# EAGLE design sells (EAGLE 6.4)
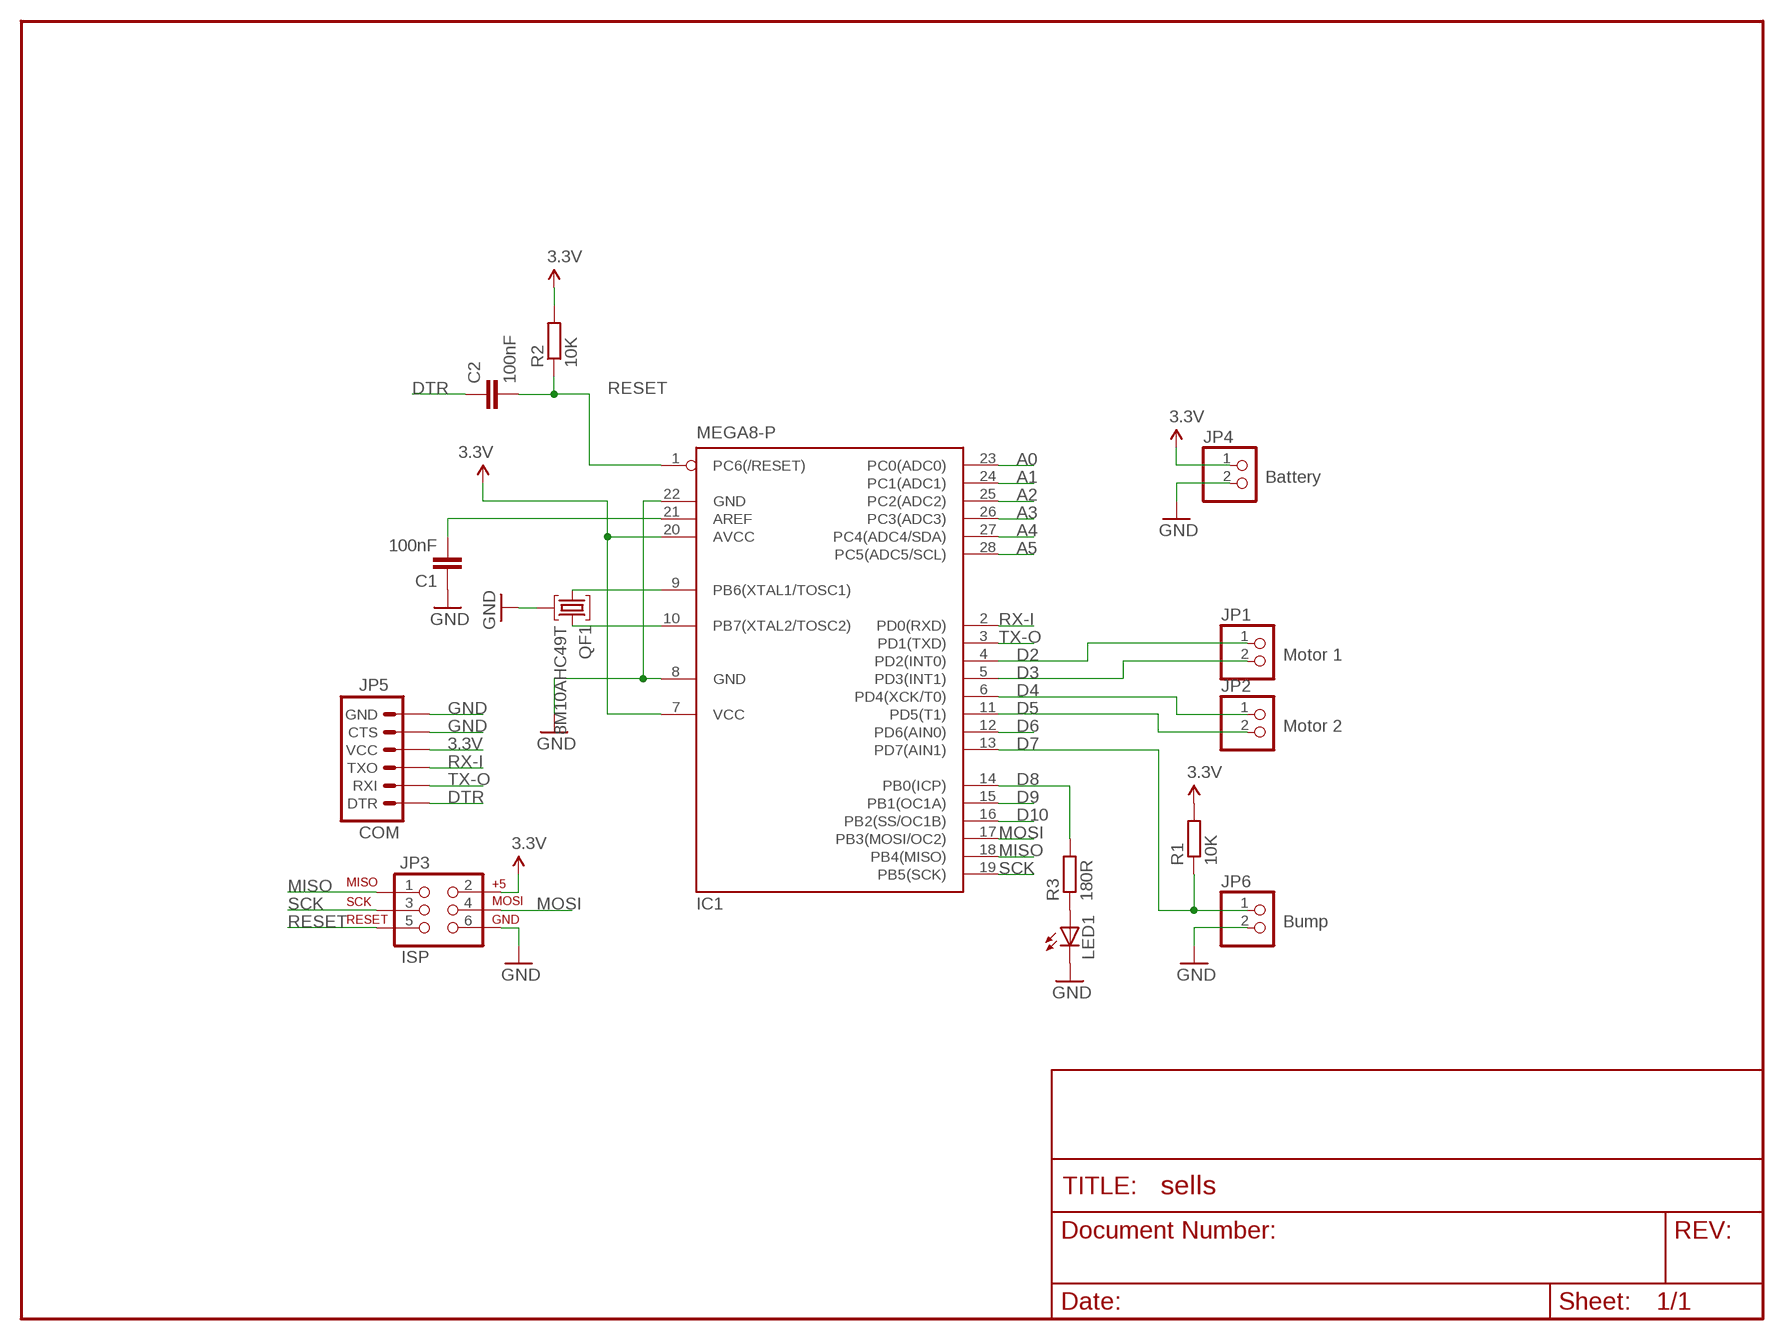
[diagram p0: schematic, sheet 1]

## Parts
C1  100nF  C-EU050-050X075  [C050-050X075]
C2  100nF  C-EU050-050X075  [C050-050X075]
IC1  MEGA8-P  [DIL28-3]
JP1  PINHD-1X2  [1X02]
JP2  PINHD-1X2  [1X02]
JP3  ISP  AVR_SPI_PRG_6PTH  [2X3]
JP4  PINHD-1X2  [1X02]
JP5  COM  ARDUINO_SERIAL_PROGRAMPTH  [1X06]
JP6  PINHD-1X2  [1X02]
LED1  LED3MM  [LED3MM]
QF1  8M10AHC49T  [HC49U]
R1  10K  R-EU_0207/10  [0207/10]
R2  10K  R-EU_0207/10  [0207/10]
R3  180R  R-EU_0207/10  [0207/10]

## Nets
3.3V: IC1.7(VCC) IC1.20(AVCC) JP3.2 JP4.1 JP5.4(VCC) R1.2 R2.2
A0: IC1.23(PC0(ADC0))
A1: IC1.24(PC1(ADC1))
A2: IC1.25(PC2(ADC2))
A3: IC1.26(PC3(ADC3))
A4: IC1.27(PC4(ADC4/SDA))
A5: IC1.28(PC5(ADC5/SCL))
D2: IC1.4(PD2(INT0)) JP1.1
D3: IC1.5(PD3(INT1)) JP1.2
D4: IC1.6(PD4(XCK/T0)) JP2.1
D5: IC1.11(PD5(T1)) JP2.2
D6: IC1.12(PD6(AIN0))
D7: IC1.13(PD7(AIN1)) JP6.1 R1.1
D8: IC1.14(PB0(ICP)) R3.2
D9: IC1.15(PB1(OC1A))
D10: IC1.16(PB2(SS/OC1B))
DTR: C2.1 JP5.1(DTR)
GND [vcc]: C1.1 IC1.8(GND) IC1.22(GND) JP3.6 JP4.2 JP5.5(CTS) JP5.6(GND) JP6.2 LED1.K(C) QF1.2
MISO: IC1.18(PB4(MISO)) JP3.1
MOSI: IC1.17(PB3(MOSI/OC2)) JP3.4
N$1: IC1.9(PB6(XTAL1/TOSC1)) QF1.1
N$2: IC1.10(PB7(XTAL2/TOSC2)) QF1.3
N$3: C1.2 IC1.21(AREF)
N$4: LED1.A R3.1
RESET: C2.2 IC1.1(PC6(/RESET)) JP3.5 R2.1
RX-I: IC1.2(PD0(RXD)) JP5.3(TXO)
SCK: IC1.19(PB5(SCK)) JP3.3
TX-O: IC1.3(PD1(TXD)) JP5.2(RXI)

## Notes on the sheet
- Battery
- Motor 1
- Motor 2
- Bump

## Library data of the parts
C1 C2 = rcl:C-EU: CAPACITOR, European symbol
IC1 = atmel:MEGA8-P: MICROCONTROLLER 8 Kbytes FLASH, 1 kbytes SRAM, 512 bytes EEPROM, USART, 4-channel 10 bit ADC, 2-channel 8 bit ADC Pin compatible with Atmega48, ATMega88, ATMega168 Source: avr.lbr; OC_FARNELL: unknown; OC_NEWARK: unknown
JP1 JP2 JP4 JP6 = pinhead:PINHD-1X2: PIN HEADER
JP3 = SparkFun:AVR_SPI_PRG_6: AVR ISP 6 Pin This is the reduced ISP connector for AVR programming. Common on Arduino. This footprint will take up less PCB space and can be used with a 10-pin to 6-pin adapter such as SKU: BOB-08508
JP5 = SparkFun:ARDUINO_SERIAL_PROGRAM
LED1 = led:LED: LED OSRAM: - CHIPLED LG R971, LG N971, LY N971, LG Q971, LY Q971, LO R971, LY R971 LH N974, LH R974 LS Q976, LO Q976, LY Q976 LO Q996 - Hyper CHIPLED LW Q18S LB Q993, LB Q99A, LB R99A - SideLED LS A670, LO A670, LY A670, LG A670, LP A670 LB A673, LV A673, LT A673, LW A673 LH A674 LY A675 LS A676, LA A676, LO A676, LY A676, LW A676 LS A679, LY A679, LG A679 - Hyper Micro SIDELED® LS Y876, LA Y876, LO Y876, LY Y876 LT Y87S - SmartLED LW L88C, LW L88S LB L89C, LB L89S, LG L890 LS L89K, LO L89K, LY L89K LS L896, LA L896, LO L896, LY L896 - TOPLED LS T670, LO T670, LY T670, LG T670, LP T670 LSG T670, LSP T670, LSY T670, LOP T670, LYG T670 LG T671, LOG T671, LSG T671 LB T673, LV T673, LT T673, LW T673 LH T674 LS T676, LA T676, LO T676, LY T676, LB T676, LH T676, LSB T676, LW T676 LB T67C, LV T67C, LT T67C, LS T67K, LO T67K, LY T67K, LW E67C LS E67B, LA E67B, LO E67B, LY E67B, LB E67C, LV E67C, LT E67C LW T67C LS T679, LY T679, LG T679 LS T770, LO T770, LY T770, LG T770, LP T770 LB T773, LV T773, LT T773, LW T773 LH T774 LS E675, LA E675, LY E675, LS T675 LS T776, LA T776, LO T776, LY T776, LB T776 LHGB T686 LT T68C, LB T68C - Hyper Mini TOPLED® LB M676 - Mini TOPLED Santana® LG M470 LS M47K, LO M47K, LY M47K Source: http://www.osram.convergy.de LUXEON: - LUMILED® LXK2-PW12-R00, LXK2-PW12-S00, LXK2-PW14-U00, LXK2-PW14-V00 LXK2-PM12-R00, LXK2-PM12-S00, LXK2-PM14-U00 LXK2-PE12-Q00, LXK2-PE12-R00, LXK2-PE12-S00, LXK2-PE14-T00, LXK2-PE14-U00 LXK2-PB12-K00, LXK2-PB12-L00, LXK2-PB12-M00, LXK2-PB14-N00, LXK2-PB14-P00, LXK2-PB14-Q00 LXK2-PR12-L00, LXK2-PR12-M00, LXK2-PR14-Q00, LXK2-PR14-R00 LXK2-PD12-Q00, LXK2-PD12-R00, LXK2-PD12-S00 LXK2-PH12-R00, LXK2-PH12-S00 LXK2-PL12-P00, LXK2-PL12-Q00, LXK2-PL12-R00 Source: www.luxeon.com KINGBRIGHT: KA-3528ASYC Source: www.kingbright.com
QF1 = crystal:8M10AHC49T: Monolithic Crystal Filters Source: www.vanlong.com; OC_FARNELL: unknown; OC_NEWARK: unknown
R1-R3 = rcl:R-EU_: RESISTOR, European symbol

## Net classes
0 default: width 0.203 mm
1 vcc: width 0.254 mm

## Board
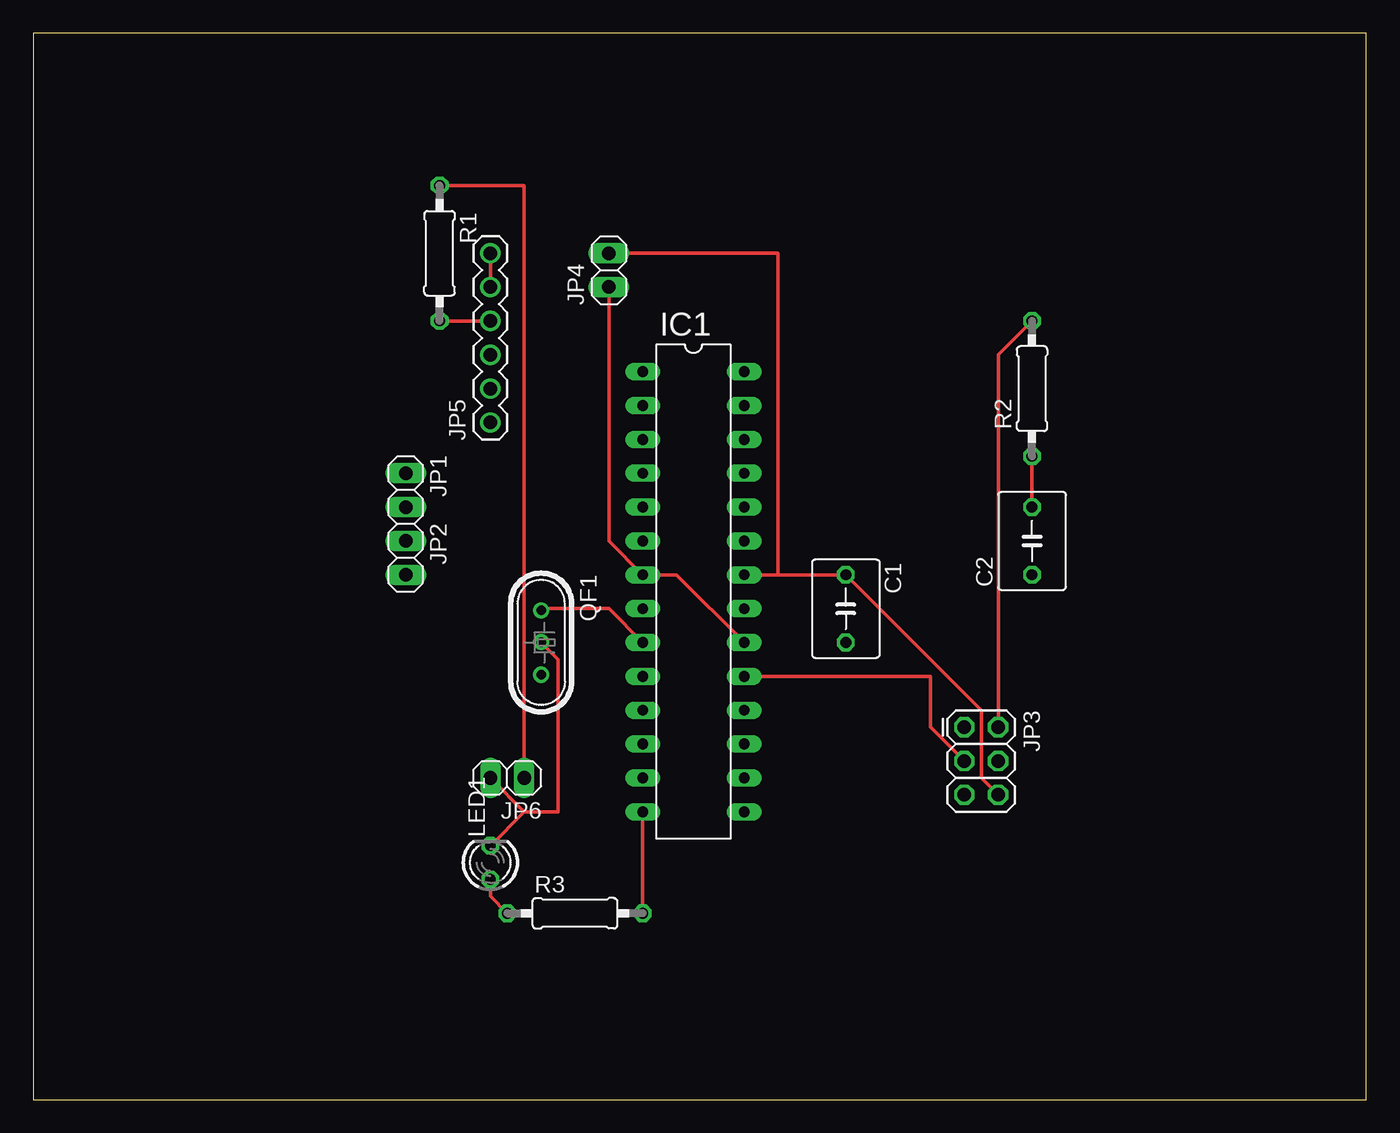
[diagram p1: board, top side]
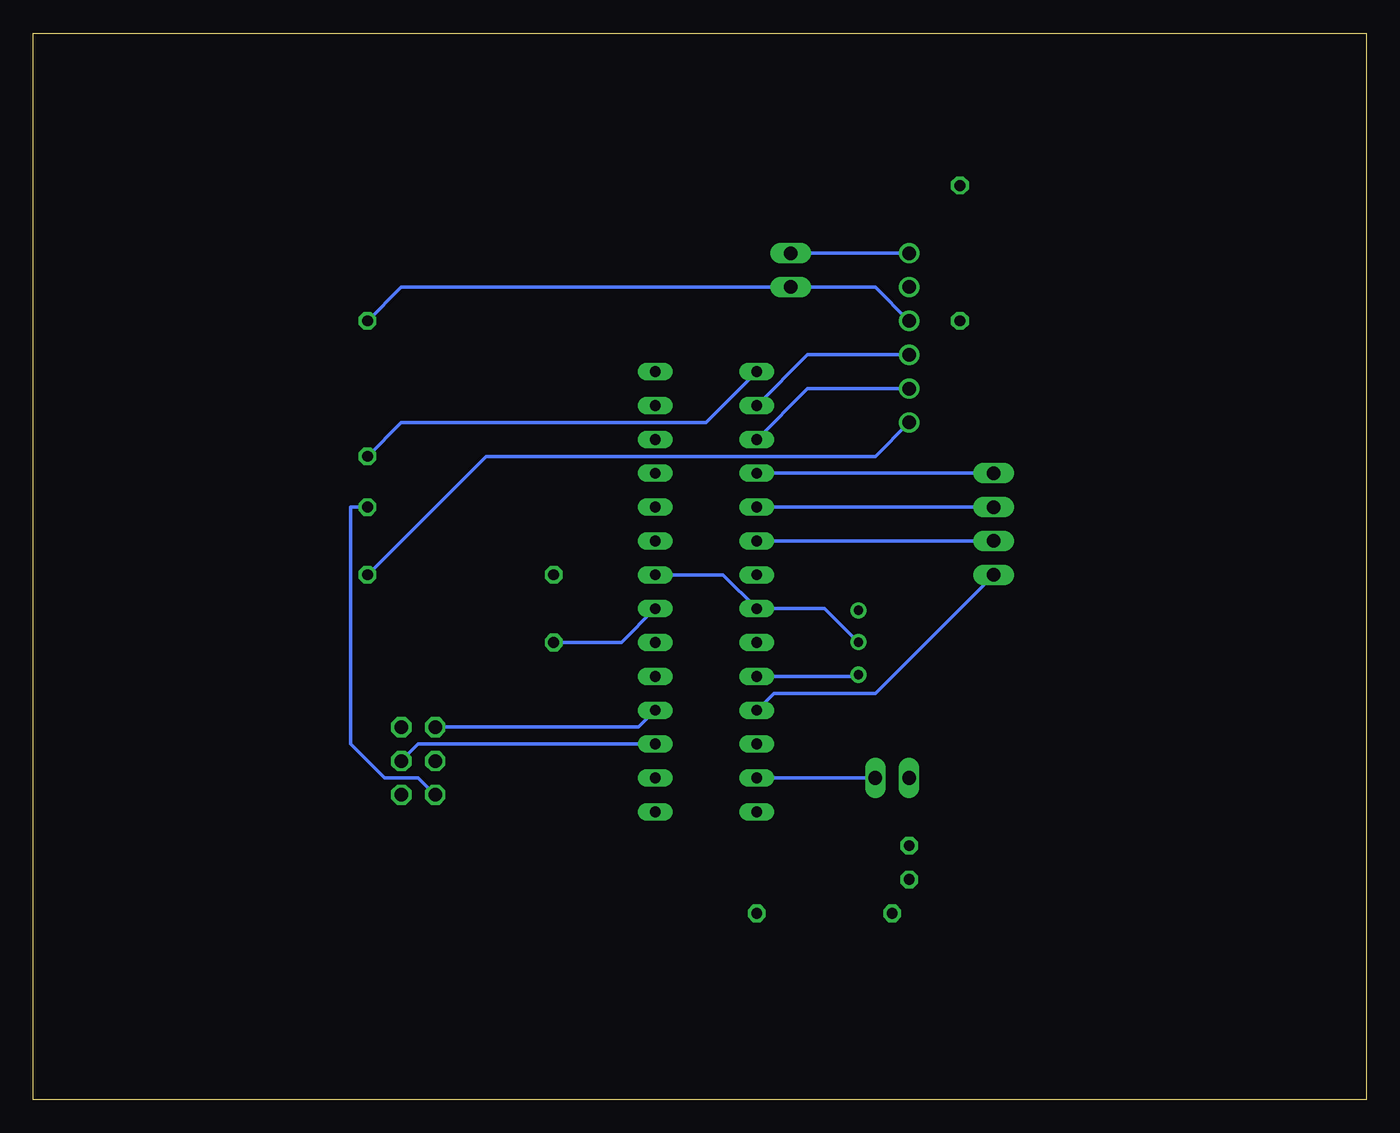
[diagram p2: board, bottom side, seen from below]

Size 100 x 80 mm. Coordinates in mm from the lower left corner, seen from the top.
Outline: 0,0 100,0 100,80 0,80 0,0
Copper layers (1*16): Top 0.035mm / dielectric 1.5mm / Bottom 0.035mm
Design rules "default": minimum track width 10mil, minimum drill 24mil, track to track 8mil, track to pad 8mil, pad to pad 8mil, via to via 8mil, smd to smd 8mil, copper to edge 40mil, drill to drill 8mil, minimum pad ring 10mil, minimum via ring 8mil, stop-mask expansion 4mil, vias tented up to drill 0mil, thermal gap 10mil

### Footprints (pad centres in the part's own frame; a part is rotated, then mirrored left to right if it is on the bottom)
C050-050X075 = drill 0.813 octagon: 1 -2.54,0; 2 2.54,0
DIL28-3 = drill 0.813 long: 1 -16.51,-3.81; 2 -13.97,-3.81; 3 -11.43,-3.81; 4 -8.89,-3.81; 5 -6.35,-3.81; 6 -3.81,-3.81; 7 -1.27,-3.81; 8 1.27,-3.81; 9 3.81,-3.81; 10 6.35,-3.81; 11 8.89,-3.81; 12 11.43,-3.81; 13 13.97,-3.81; 14 16.51,-3.81; 15 16.51,3.81; 16 13.97,3.81; 17 11.43,3.81; 18 8.89,3.81; 19 6.35,3.81; 20 3.81,3.81; 21 1.27,3.81; 22 -1.27,3.81; 23 -3.81,3.81; 24 -6.35,3.81; 25 -8.89,3.81; 26 -11.43,3.81; 27 -13.97,3.81; 28 -16.51,3.81
1X02 = drill 1.016 long: 1 -1.27,0; 2 1.27,0
2X3 = drill 1.016 octagon: 1 0,0; 2 0,2.54; 3 2.54,0; 4 2.54,2.54; 5 5.08,0; 6 5.08,2.54
1X06 = drill 1.016: 1 0,0; 2 2.54,0; 3 5.08,0; 4 7.62,0; 5 10.16,0; 6 12.7,0
LED3MM = drill 0.813 octagon: A -1.27,0; K 1.27,0
HC49U = drill 0.7 pad 1.2: 1 -2.413,0; 2 -0.027,0; 3 2.413,0
0207/10 = drill 0.813 octagon: 1 -5.08,0; 2 5.08,0

### Placement (x,y rotation side)
C1  60.96,36.83 270 top
C2  74.93,41.91 90 top
IC1  49.53,38.1 270 top
JP1  27.94,45.72 270 top
JP2  27.94,40.64 270 top
JP3  69.85,27.94 270 top
JP4  43.18,62.23 90 top
JP5  34.29,50.8 90 top
JP6  35.56,24.13 180 top
LED1  34.29,17.78 90 top
QF1  38.1,34.29 270 top
R1  30.48,63.5 270 top
R2  74.93,53.34 90 top
R3  40.64,13.97 0 top

### Tracks (layer width: path | path; a pad name or v marks a point on that pad's centre or on a via)
3.3V
  Top 0.254: R2.2 72.39,55.88 JP3.2 | JP5.4 R1.2 | JP4.1 43.18,41.91 IC1.7 48.26,39.37 IC1.20
  Bottom 0.254: JP5.4 36.83,60.96 JP4.1 72.39,60.96 R2.2
D2
  Bottom 0.254: JP1.1 IC1.4
D3
  Bottom 0.254: JP1.2 IC1.5
D4
  Bottom 0.254: JP2.1 IC1.6
D5
  Bottom 0.254: IC1.11 44.45,30.48 36.83,30.48 JP2.2
D7
  Top 0.254: R1.1 36.83,68.58 JP6.1
  Bottom 0.254: JP6.1 IC1.13
D8
  Top 0.254: IC1.14 R3.2
DTR
  Bottom 0.254: C2.1 66.04,48.26 36.83,48.26 JP5.1
GND
  Top 0.254: 36.83,21.59 JP6.2 | 36.83,21.59 39.37,21.59 39.37,33.02 38.1,34.29 QF1.2 | JP5.6 JP5.5 | 55.88,39.37 C1.1 71.12,29.21 71.12,24.13 JP3.6 | 55.88,39.37 IC1.22 | JP4.2 55.88,63.5 55.88,39.37 | 36.83,21.59 LED1.K
  Bottom 0.254: QF1.2 38.1,34.29 40.64,36.83 IC1.8 48.26,39.37 IC1.22 | JP5.6 JP4.2
MISO
  Bottom 0.254: IC1.18 54.61,27.94 JP3.1
MOSI
  Bottom 0.254: IC1.17 71.12,26.67 JP3.4
N$1
  Top 0.254: IC1.9 43.18,36.83 38.1,36.83 QF1.1
N$2
  Bottom 0.254: IC1.10 38.1,31.75 QF1.3
N$3
  Bottom 0.254: IC1.21 55.88,34.29 C1.2
N$4
  Top 0.254: R3.1 34.29,15.24 LED1.A
RESET
  Top 0.254: R2.1 C2.2
  Bottom 0.254: IC1.1 49.53,50.8 72.39,50.8 R2.1 | JP3.5 71.12,24.13 73.66,24.13 76.2,26.67 76.2,44.45 C2.2
RX-I
  Bottom 0.254: IC1.2 41.91,55.88 JP5.3
SCK
  Top 0.254: IC1.19 67.31,31.75 67.31,27.94 JP3.3
TX-O
  Bottom 0.254: IC1.3 41.91,53.34 JP5.2